# Altium project SunS_fixture_EGSE.PrjPcb
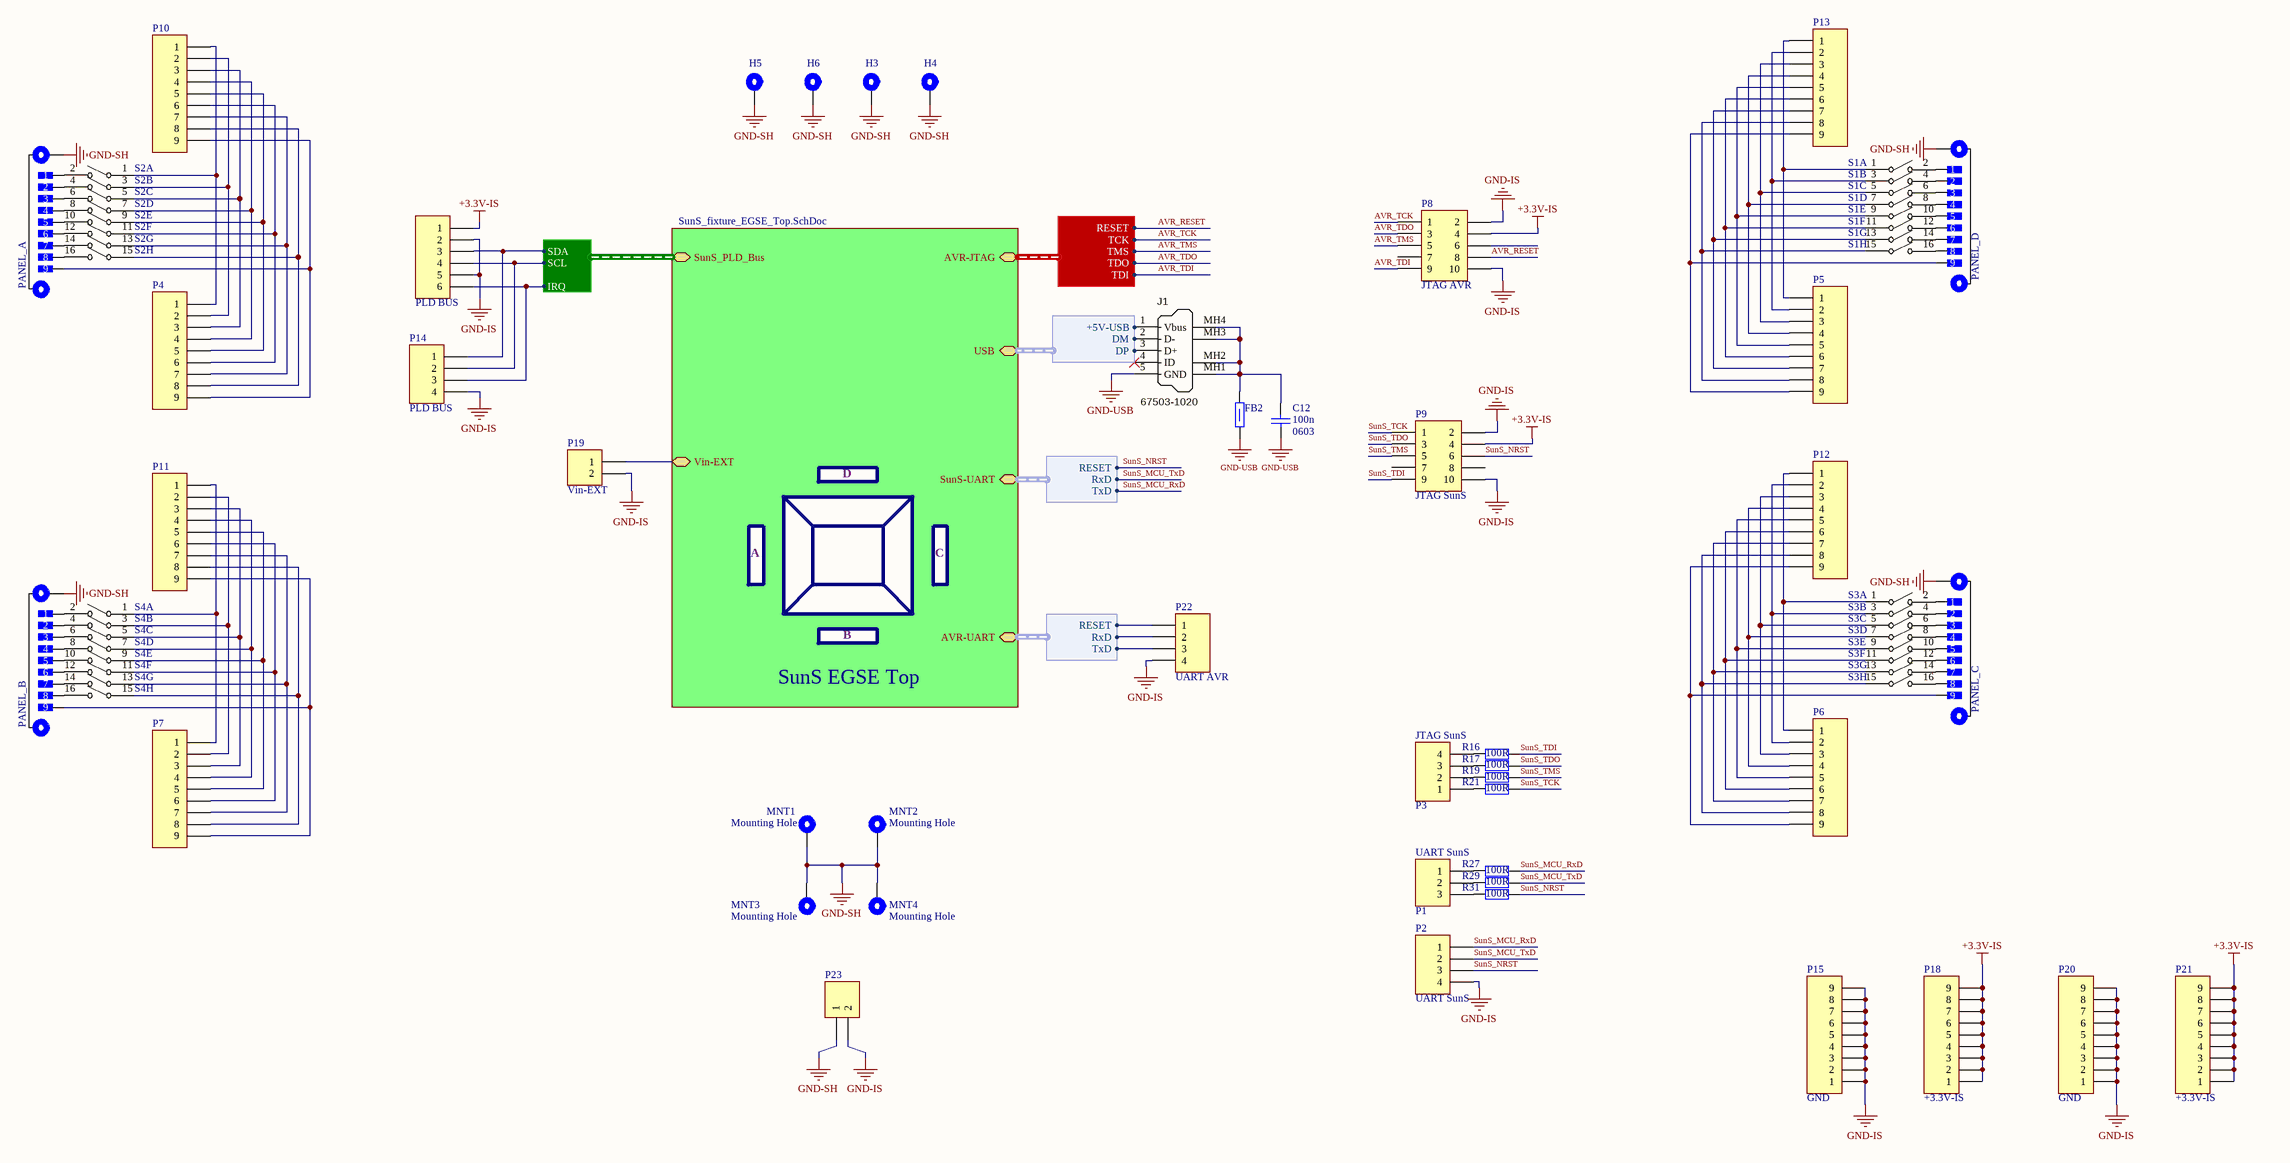
[diagram p0: SunS_fixture_EGSE_Connectors.SchDoc]
ApprovedBy_Name: (not approved); Author_Name: Micha³ Gumiela; CheckedBy_Name: (not checked); Equipment: Fixture EGSE; Model: EGSE; PCB_Author: (pcbdoc author); PCB_CheckedBy: (not checked); PCB_DocName: Fixture EGSE; PCB_DocNo: PWSat2-xxx-DW-xxx; PCB_Id: Fixture EGSE; PCB_Revision: 1; Project_FullName: PW-Sat2; Project_Id: SunS Fixture EGSE; Project_ShortName: SunS; Schematics_DocName: Fixture EGSE; Schematics_DocNo: PWSat2-xxx-DW-xxx; Schematics_Revision: 1; Subsystem: SunS
7 sheets, 120 parts. Net scope: hierarchical (ports join the sheet entries above them; power ports are global).
Board file: SunS_fixture_EGSE.PcbDoc
Sheets:
  SunS_fixture_EGSE_Connectors.SchDoc
    SunS EGSE Top = SunS_fixture_EGSE_Top.SchDoc
      SunS_UART = SunS_fixture_EGSE_UART_Isolation.SchDoc
      FTDI = SunS_fixture_EGSE_FTDI.SchDoc
      AVR = SunS_fixture_EGSE_AVR.SchDoc
      External Supply = SunS_fixture_EGSE_External_Supply.SchDoc
      LDO = SunS_fixture_EGSE_LDO.SchDoc
      AVR_UART = SunS_fixture_EGSE_UART_Isolation.SchDoc

## Sheet SunS_fixture_EGSE_Connectors.SchDoc: Connectors
size A1; Author: Michał Gumiela; ProjectName: SunS

### Parts
C12  value 100n  Package: 0603  [SMD_Capacitor_0603]  (hidden comment: Cap)
FB2  120R/100MHz  [SMD_FerriteBead_1206]  (value not drawn)
H3  Mounting Hole  [SunS_PcbMntHole_M2]  (value not drawn)
H4  Mounting Hole  [SunS_PcbMntHole_M2]  (value not drawn)
H5  Mounting Hole  [SunS_PcbMntHole_M2]  (value not drawn)
H6  Mounting Hole  [SunS_PcbMntHole_M2]  (value not drawn)
J1  Manufacturer Part Number 1: 67503-1020  [USB_Mini-B_Molex_SMT]  (hidden comment: USB_Mini-B)
MNT1  Mounting Hole  [PC-104_PcbMntHole_M3]
MNT2  Mounting Hole  [PC-104_PcbMntHole_M3]
MNT3  Mounting Hole  [PC-104_PcbMntHole_M3]
MNT4  Mounting Hole  [PC-104_PcbMntHole_M3]
P1  UART SunS  [Mill-Max 854-22-003-10-001101]
P2  UART SunS  [HEADER 1x4 MALE]
P3  JTAG SunS  [Mill-Max 854-22-004-10-001101]
P4  Mill-Max 854-22-009-10-001101  [Mill-Max 854-22-009-10-001101]  (value not drawn)
P5  Mill-Max 854-22-009-10-001101  [Mill-Max 854-22-009-10-001101]  (value not drawn)
P6  Mill-Max 854-22-009-10-001101  [Mill-Max 854-22-009-10-001101]  (value not drawn)
P7  Mill-Max 854-22-009-10-001101  [Mill-Max 854-22-009-10-001101]  (value not drawn)
P8  JTAG AVR  [IDC-10-Male-Socket]
P9  JTAG SunS  [IDC-10-Male-Socket]
P10  Header 9  [HEADER 1x9 MALE]  (value not drawn)
P11  Header 9  [HEADER 1x9 MALE]  (value not drawn)
P12  Header 9  [HEADER 1x9 MALE]  (value not drawn)
P13  Header 9  [HEADER 1x9 MALE]  (value not drawn)
P14  PLD BUS  [HEADER 1x4 MALE]
P15  GND  [HEADER 1x9 MALE]
P18  +3.3V-IS  [HEADER 1x9 MALE]
P19  Vin-EXT  [HEADER 1X2H Male]
P20  GND  [HEADER 1x9 MALE]
P21  +3.3V-IS  [HEADER 1x9 MALE]
P22  UART AVR  [HEADER 1x4 MALE]
P23  Header 2  [HEADER 1X2 Male]  (value not drawn)
PANEL_A  fixture_ALS_9_pad_1mm_pitch  [fixture_ALS_9_pad_1mm_pitch]  (value not drawn)
PANEL_B  fixture_ALS_9_pad_1mm_pitch  [fixture_ALS_9_pad_1mm_pitch]  (value not drawn)
PANEL_C  fixture_ALS_9_pad_1mm_pitch  [fixture_ALS_9_pad_1mm_pitch]  (value not drawn)
PANEL_D  fixture_ALS_9_pad_1mm_pitch  [fixture_ALS_9_pad_1mm_pitch]  (value not drawn)
PLD_BUS  Mill-Max 854-22-006-10-001101  [Mill-Max 854-22-006-10-001101]  (value not drawn)
R16  100R  [SMD_Resistor_0603]
R17  100R  [SMD_Resistor_0603]
R19  100R  [SMD_Resistor_0603]
R21  100R  [SMD_Resistor_0603]
R27  100R  [SMD_Resistor_0603]
R29  100R  [SMD_Resistor_0603]
R31  100R  [SMD_Resistor_0603]
S1  MCEPM-08  [MCEPM-08]  (value not drawn)  (parts A,B,C,D,E,F,G,H of 8)
S2  MCEPM-08  [MCEPM-08]  (value not drawn)  (parts A,B,C,D,E,F,G,H of 8)
S3  MCEPM-08  [MCEPM-08]  (value not drawn)  (parts A,B,C,D,E,F,G,H of 8)
S4  MCEPM-08  [MCEPM-08]  (value not drawn)  (parts A,B,C,D,E,F,G,H of 8)

### Sub-sheets
SunS EGSE Top = SunS_fixture_EGSE_Top.SchDoc: SunS_PLD_Bus (harness SunS_PLD_Bus), AVR-JTAG (harness JTAG), USB (harness USB), SunS-UART (harness UART), Vin-EXT, AVR-UART (harness UART)

### Harnesses
SunS_PLD_Bus: SCL, SDA, IRQ
JTAG: TDO, TDI, TMS, TCK, RESET
USB: DM, DP, +5V-USB
UART: TxD, RxD, RESET

### Nets
+3.3V-IS: P8.4 P9.4 P18.1 P18.2 P18.3 P18.4 P18.5 P18.6 P18.7 P18.8 P18.9 P21.1 P21.2 P21.3 P21.4 P21.5 P21.6 P21.7 P21.8 P21.9 PLD_BUS.1
GND-IS: P2.4 P8.2 P8.10 P9.2 P9.10 P14.4 P15.1 P15.2 P15.3 P15.4 P15.5 P15.6 P15.7 P15.8 P15.9 P19.2 P20.1 P20.2 P20.3 P20.4 P20.5 P20.6 P20.7 P20.8 P20.9 P22.4 P23.2 PLD_BUS.2 PLD_BUS.5
GND-SH: H3.1 H4.1 H5.1 H6.1 MNT1.1 MNT2.1 MNT3.1 MNT4.1 P23.1 PANEL_A.0 PANEL_B.0 PANEL_C.0 PANEL_D.0
GND-USB: C12.2 FB2.2 J1.5(GND)
_IRQ: P14.3 PLD_BUS.6 ; sheet SunS EGSE Top/SunS_PLD_Bus.IRQ
_SCL: P14.2 PLD_BUS.4 ; sheet SunS EGSE Top/SunS_PLD_Bus.SCL
_SDA: P14.1 PLD_BUS.3 ; sheet SunS EGSE Top/SunS_PLD_Bus.SDA
AVR_RESET: P8.8 ; sheet SunS EGSE Top/AVR-JTAG.RESET
AVR_TCK: P8.1 ; sheet SunS EGSE Top/AVR-JTAG.TCK
AVR_TDI: P8.9 ; sheet SunS EGSE Top/AVR-JTAG.TDI
AVR_TDO: P8.3 ; sheet SunS EGSE Top/AVR-JTAG.TDO
AVR_TMS: P8.5 ; sheet SunS EGSE Top/AVR-JTAG.TMS
DTR#1: P22.1 ; sheet SunS EGSE Top/AVR-UART.RESET
RxD1: P22.2 ; sheet SunS EGSE Top/AVR-UART.RxD
SunS_MCU_RxD: P2.1 R27.1 ; sheet SunS EGSE Top/SunS-UART.TxD
SunS_MCU_TxD: P2.2 R29.1 ; sheet SunS EGSE Top/SunS-UART.RxD
SunS_NRST: P2.3 P9.6 R31.1 ; sheet SunS EGSE Top/SunS-UART.RESET
SunS_TCK: P9.1 R21.1
SunS_TDI: P9.9 R16.1
SunS_TDO: P9.3 R17.1
SunS_TMS: P9.5 R19.1
TxD1: P22.3 ; sheet SunS EGSE Top/AVR-UART.TxD
USB_N: J1.2(D-) ; sheet SunS EGSE Top/USB.DM
USB_P: J1.3(D+) ; sheet SunS EGSE Top/USB.DP
NetC12_1: C12.1 FB2.1 J1.MH1(Shell) J1.MH2(Shell) J1.MH3(Shell) J1.MH4(Shell)
NetFB1_2: J1.1(Vbus) ; sheet SunS EGSE Top/USB.+5V-USB
NetP1_1: P1.1 R27.2
NetP1_2: P1.2 R29.2
NetP1_3: P1.3 R31.2
NetP3_1: P3.1 R21.2
NetP3_2: P3.2 R19.2
NetP3_3: P3.3 R17.2
NetP3_4: P3.4 R16.2
NetP4_1: P4.1 P10.1 S2.1
NetP4_2: P4.2 P10.2 S2.3
NetP4_3: P4.3 P10.3 S2.5
NetP4_4: P4.4 P10.4 S2.7
NetP4_5: P4.5 P10.5 S2.9
NetP4_6: P4.6 P10.6 S2.11
NetP4_7: P4.7 P10.7 S2.13
NetP4_8: P4.8 P10.8 S2.15
NetP4_9: P4.9 P10.9 PANEL_A.9
NetP5_1: P5.1 P13.1 S1.1
NetP5_2: P5.2 P13.2 S1.3
NetP5_3: P5.3 P13.3 S1.5
NetP5_4: P5.4 P13.4 S1.7
NetP5_5: P5.5 P13.5 S1.9
NetP5_6: P5.6 P13.6 S1.11
NetP5_7: P5.7 P13.7 S1.13
NetP5_8: P5.8 P13.8 S1.15
NetP5_9: P5.9 P13.9 PANEL_D.9
NetP6_1: P6.1 P12.1 S3.1
NetP6_2: P6.2 P12.2 S3.3
NetP6_3: P6.3 P12.3 S3.5
NetP6_4: P6.4 P12.4 S3.7
NetP6_5: P6.5 P12.5 S3.9
NetP6_6: P6.6 P12.6 S3.11
NetP6_7: P6.7 P12.7 S3.13
NetP6_8: P6.8 P12.8 S3.15
NetP6_9: P6.9 P12.9 PANEL_C.9
NetP7_1: P7.1 P11.1 S4.1
NetP7_2: P7.2 P11.2 S4.3
NetP7_3: P7.3 P11.3 S4.5
NetP7_4: P7.4 P11.4 S4.7
NetP7_5: P7.5 P11.5 S4.9
NetP7_6: P7.6 P11.6 S4.11
NetP7_7: P7.7 P11.7 S4.13
NetP7_8: P7.8 P11.8 S4.15
NetP7_9: P7.9 P11.9 PANEL_B.9
NetP19_1: P19.1 ; sheet SunS EGSE Top/Vin-EXT
NetPANEL_A_1: PANEL_A.1 S2.2
NetPANEL_A_2: PANEL_A.2 S2.4
NetPANEL_A_3: PANEL_A.3 S2.6
NetPANEL_A_4: PANEL_A.4 S2.8
NetPANEL_A_5: PANEL_A.5 S2.10
NetPANEL_A_6: PANEL_A.6 S2.12
NetPANEL_A_7: PANEL_A.7 S2.14
NetPANEL_A_8: PANEL_A.8 S2.16
NetPANEL_B_1: PANEL_B.1 S4.2
NetPANEL_B_2: PANEL_B.2 S4.4
NetPANEL_B_3: PANEL_B.3 S4.6
NetPANEL_B_4: PANEL_B.4 S4.8
NetPANEL_B_5: PANEL_B.5 S4.10
NetPANEL_B_6: PANEL_B.6 S4.12
NetPANEL_B_7: PANEL_B.7 S4.14
NetPANEL_B_8: PANEL_B.8 S4.16
NetPANEL_C_1: PANEL_C.1 S3.2
NetPANEL_C_2: PANEL_C.2 S3.4
NetPANEL_C_3: PANEL_C.3 S3.6
NetPANEL_C_4: PANEL_C.4 S3.8
NetPANEL_C_5: PANEL_C.5 S3.10
NetPANEL_C_6: PANEL_C.6 S3.12
NetPANEL_C_7: PANEL_C.7 S3.14
NetPANEL_C_8: PANEL_C.8 S3.16
NetPANEL_D_1: PANEL_D.1 S1.2
NetPANEL_D_2: PANEL_D.2 S1.4
NetPANEL_D_3: PANEL_D.3 S1.6
NetPANEL_D_4: PANEL_D.4 S1.8
NetPANEL_D_5: PANEL_D.5 S1.10
NetPANEL_D_6: PANEL_D.6 S1.12
NetPANEL_D_7: PANEL_D.7 S1.14
NetPANEL_D_8: PANEL_D.8 S1.16

Not connected (* = marked no-connect by the designer): J1 4(ID)*; P8 6 7; P9 7 8

### Notes on the sheet
- D
- A
- C
- B
- Title:
- Project:
- Author:
- Model:
- File name:
- Document Number:
- Checked by:
- Rev:
- Date:
- Approved by:
- Sheet:
- of

### Library data of the parts
FB2 = BLM31PG121SH1L: Ferrite bead, 1206, 0.02HM, 3.5A.; Manufacturer: Murata; Current Rating: 3.5A; Series Resistance DC: 0.02R; Package: 1206; Value: 120R/100MHz; ManufacturerPartNumber: BLM31PG121SH1L
H3-H6 MNT1-MNT4 = MntHole: PCB Mounting Hole; Value: Mounting Hole
J1 = USB_Mini-B: Connector SMD USB Type Mini-B; Manufacturer 1: Molex Connector Corporation; SCDType: undef; Package / Case: SMD; Supplier 1: Digi-Key; Supplier Part Number 1: WM5461CT-ND
P1 = Mill-Max 854-22-003-10-001101: SPRING-LOADED CONNECTORS, 854-22-003-10-001101, 1.27 mm pitch, 1x3pin, THT
P2 P22 = Header 4: Header, 4-Pin; LatestRevisionDate: 17-Jul-2002; LatestRevisionNote: Re-released for DXP Platform.; Publisher: Altium Limited
P3 = Mill-Max 854-22-004-10-001101: SPRING-LOADED CONNECTORS, 854-22-004-10-001101, 1.27 mm pitch, 1x4pin, THT.
P4-P7 = Mill-Max 854-22-009-10-001101: SPRING-LOADED CONNECTORS, 854-22-009-10-001101, 1.27 mm pitch, 1x9pin, THT.
P8 P9 = Header 5X2: Header, 5-Pin, Dual row
P10-P13 P15 P18 P20 P21 = Header 9: Header, 9-Pin; LatestRevisionDate: 17-Jul-2002; LatestRevisionNote: Re-released for DXP Platform.; Publisher: Altium Limited
P14 = Header 4x1: Header, 4-Pin; LatestRevisionDate: 17-Jul-2002; LatestRevisionNote: Re-released for DXP Platform.; Publisher: Altium Limited
P19 P23 = Header 2: Header, 2-Pin; LatestRevisionDate: 17-Jul-2002; LatestRevisionNote: Re-released for DXP Platform.; Publisher: Altium Limited
PANEL_A PANEL_B PANEL_C PANEL_D = fixture_ALS_9_pad_1mm_pitch: ALS Panel Fixture Connection; Value: fixture_ALS_9_pad_1mm_pitch
PLD_BUS = Mill-Max 854-22-006-10-001101: SPRING-LOADED CONNECTORS, 854-22-006-10-001101, 1.27 mm pitch, 1x6pin, THT.
R16 R17 R19 R21 R27 R29 R31 = Res: Value: 100R; Package: 0603
S1-S4 = MCEPM-08: Supplier 1: Farnell

## Sheet SunS_fixture_EGSE_Top.SchDoc: Top
size A3; Author: Michał Gumiela; ProjectName: SunS
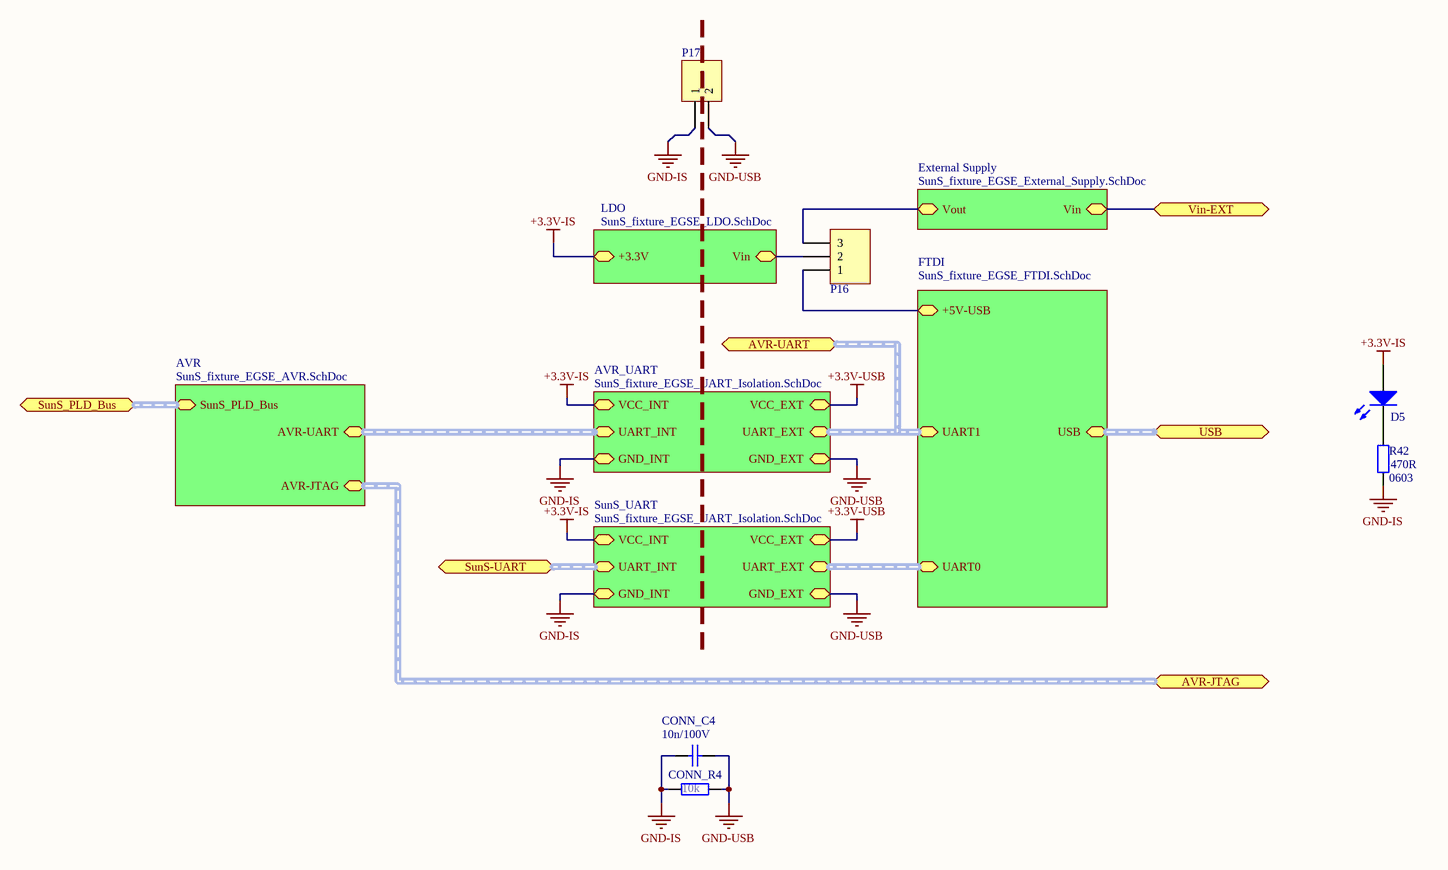
[diagram p1: SunS_fixture_EGSE_Top.SchDoc]

### Parts
CONN_C4  10n/100V  [SMD_Capacitor_0805]
CONN_R4  10k  [SMD_Resistor_0805]
D5  LEDX  [LED 0805 RED]  (value not drawn)
P16  Header 3  [HEADER 1X3 MALE]  (value not drawn)
P17  Header 2  [HEADER 1X2 Male]  (value not drawn)
R42  Package: 0603  [SMD_Resistor_0603]  (hidden comment: 470R)

### Sub-sheets
AVR = SunS_fixture_EGSE_AVR.SchDoc: SunS_PLD_Bus (harness SunS_PLD_Bus), AVR-UART (harness UART), AVR-JTAG (harness JTAG)
AVR_UART = SunS_fixture_EGSE_UART_Isolation.SchDoc: UART_INT (harness UART), UART_EXT (harness UART), GND_INT, VCC_INT, GND_EXT, VCC_EXT
External Supply = SunS_fixture_EGSE_External_Supply.SchDoc: Vout, Vin
FTDI = SunS_fixture_EGSE_FTDI.SchDoc: UART0 (harness UART), UART1 (harness UART), USB (harness USB), +5V-USB
LDO = SunS_fixture_EGSE_LDO.SchDoc: Vin, +3.3V
SunS_UART = SunS_fixture_EGSE_UART_Isolation.SchDoc: UART_INT (harness UART), UART_EXT (harness UART), GND_INT, VCC_INT, GND_EXT, VCC_EXT

### Ports
AVR-JTAG (harness JTAG), AVR-UART (harness UART), SunS-UART (harness UART), SunS_PLD_Bus (harness SunS_PLD_Bus), USB (harness SunS_PLD_Bus), Vin-EXT

### Nets
+3.3V-IS: D5.1(A) ; sheet SunS_UART/VCC_INT, sheet LDO/+3.3V, sheet AVR_UART/VCC_INT
+3.3V-USB: sheet SunS_UART/VCC_EXT, sheet AVR_UART/VCC_EXT
+5V-USB: P16.1 ; sheet FTDI/+5V-USB
GND-IS: CONN_C4.1 CONN_R4.1 P17.1 R42.1 ; sheet SunS_UART/GND_INT, sheet AVR_UART/GND_INT
GND-USB: CONN_C4.2 CONN_R4.2 P17.2 ; sheet SunS_UART/GND_EXT, sheet AVR_UART/GND_EXT
NetC9_1: P16.2 ; sheet LDO/Vin
NetD5_2: D5.2(K) R42.2
NetP16_3: P16.3 ; sheet External Supply/Vout
NetP19_1: port Vin-EXT, sheet External Supply/Vin

### Buses and harness runs
harness port AVR-JTAG = sheet AVR/AVR-JTAG
harness port AVR-UART = sheet AVR_UART/UART_EXT = sheet FTDI/UART1
harness port SunS-UART = sheet SunS_UART/UART_INT
harness port SunS_PLD_Bus = sheet AVR/SunS_PLD_Bus
harness port USB = sheet FTDI/USB
harness sheet AVR/AVR-UART = sheet AVR_UART/UART_INT
harness sheet FTDI/UART0 = sheet SunS_UART/UART_EXT

### Notes on the sheet
- Title:
- Project:
- Author:
- Model:
- Document Number:
- Checked by:
- Rev:
- Date:
- Approved by:
- Sheet:
- of
- File name:

### Library data of the parts
CONN_C4 = Cer_C0805T104K1RCLTU: Ceramic Cap Kemet COTS 100n/100V X7R 0805; ManufacturerPartNumber: C0805T104K1RCLTU; Manufacturer: Kemet; Package: 0805; Value: 10n/100V
CONN_R4 = CRCW08051K00FKxxxx: 1k/1% Vishay CRCW 0805 Resistor. 125mW, 100ppm, 150V.; Manufacturer: Vishay; ManufacturerPartNumber: CRCW08051K00FKxxxx; Value: 10k; Package: 0805
D5 = LEDX: Typical LED
P16 = Header 3: Header, 3-Pin; LatestRevisionDate: 17-Jul-2002; LatestRevisionNote: Re-released for DXP Platform.; Publisher: Altium Limited
P17 = Header 2: Header, 2-Pin; LatestRevisionDate: 17-Jul-2002; LatestRevisionNote: Re-released for DXP Platform.; Publisher: Altium Limited
R42 = Res: Value: 470R

## Sheet SunS_fixture_EGSE_UART_Isolation.SchDoc: Connectors
size A4; Author: Michał Gumiela; ProjectName: SunS
Used 2 times, as channels SunS EGSE Top/SunS_UART, SunS EGSE Top/AVR_UART. Parts and nets are listed once, with the designators drawn on the sheet.
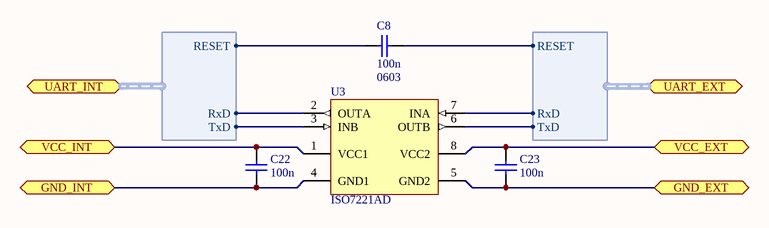
[diagram p2: SunS_fixture_EGSE_UART_Isolation.SchDoc]

### Parts
C8  value 100n  Package: 0603  [SMD_Capacitor_0603]  (hidden comment: Cap)
C22  value 100n  [SMD_Capacitor_0603]  (hidden comment: Cap)
C23  value 100n  [SMD_Capacitor_0603]  (hidden comment: Cap)
U3  ISO7221AD  [D0008A_N]

### Ports
GND_EXT, GND_INT, UART_EXT (harness UART), UART_INT (harness UART), VCC_EXT, VCC_INT

### Harnesses
UART: TxD, RxD, RESET

### Nets
GND_EXT: C23.2 U3.5(GND2) ; port GND_EXT
GND_INT: C22.2 U3.4(GND1) ; port GND_INT
VCC_EXT: C23.1 U3.8(VCC2) ; port VCC_EXT
VCC_INT: C22.1 U3.1(VCC1) ; port VCC_INT
NetC8_1: C8.1 ; port UART_INT.RESET
NetC8_2: C8.2 ; port UART_EXT.RESET
NetU3_2: U3.2(OUTA) ; port UART_INT.RxD
NetU3_3: U3.3(INB) ; port UART_INT.TxD
NetU3_6: U3.6(OUTB) ; port UART_EXT.TxD
NetU3_7: U3.7(INA) ; port UART_EXT.RxD

### Channels
SunS EGSE Top/SunS_UART: designators end in _SunS_UART; ports GND_EXT=GND-USB GND_INT=GND-IS VCC_EXT=+3.3V-USB VCC_INT=+3.3V-IS
SunS EGSE Top/AVR_UART: designators end in _AVR_UART; ports GND_EXT=GND-USB GND_INT=GND-IS VCC_EXT=+3.3V-USB VCC_INT=+3.3V-IS

### Notes on the sheet
- Title:
- Project:
- Author:
- Model:
- Document Number:
- Checked by:
- Rev:
- Date:
- Approved by:
- Sheet:
- of
- File name:

### Library data of the parts
U3 = ISO7221AD: 1 Mbps Dual Channels, 1 / 1, Digital Isolator, 3.3 V / 5 V, -40 to +125 degC, 8-pin SOIC (D), Green (RoHS & no Sb/Br); Manufacturer: Texas Instruments; Datarate(Mbps): 1; Input Noise Filter: Yes; Insulation Rating(VRMS): 2500; Prop Delay(Max)(ns): 475; Rating: Catalog; Supply Voltage(s)(V): 3.3, 5; TTL/CMOS Input Threshold: TTL; DatasheetVersion: SLLS755L; PackageVersion: 4040047-3/M, 06/2011; PackageReference: D0008A; PackageDescription: 8-Pin Plastic Small Outline, Body 4.9 x 3.9 mm, Pitch 1.27 mm; Supplier 1: Digi-Key; Supplier Part Number 1: 296-26077-5-ND; Supplier 2: Farnell; Supplier Part Number 2: 1390651; Supplier 3: Newark; Supplier Part Number 3: 48M0672; Supplier 4: Mouser; Supplier Part Number 4: 595-ISO7221AD; Eco-Plan: Green (RoHS & no Sb/Br); SubFamily: Isolator; Thermal Shutdown: No; MountType: SMT; Code_JEDEC: MS-012; PartNumber: ISO7221AD; ComponentLink1Description: Manufacturer URL; ComponentLink1URL: http://www.ti.com/; ComponentLink2Description: Datasheet; ComponentLink2URL: http://www.ti.com/general/docs/lit/getliterature.tsp?genericPartNumber=ISO7221A&fileType=pdf; ComponentLink3Description: Package Specification; ComponentLink3URL: http://www.ti.com/litv/pdf/msoi002j; ComponentLink4Description: SamplesURL; ComponentLink4URL: http://www.ti.com/product/iso7221a#samples
C8 C22 C23 = Cap
  C22 C23: Package: 0603

## Sheet SunS_fixture_EGSE_FTDI.SchDoc: Connectors
size A3; Author: Michał Gumiela; ProjectName: SunS
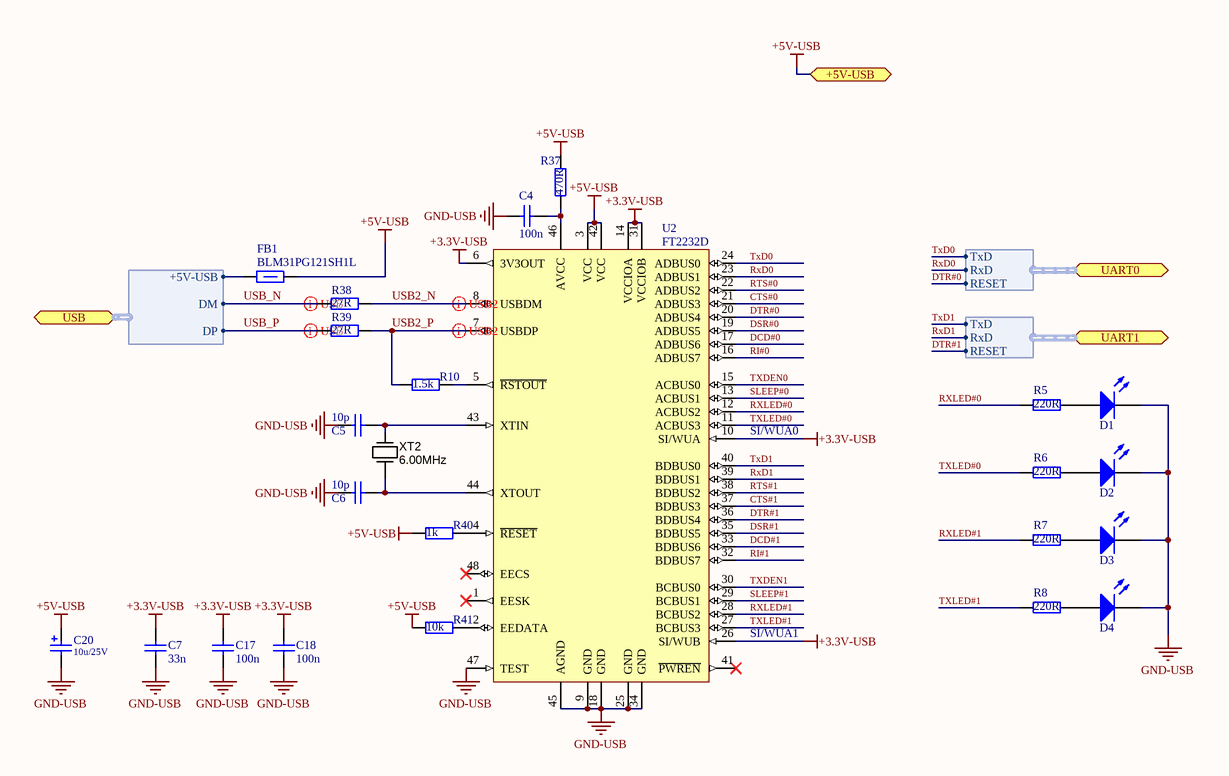
[diagram p3: SunS_fixture_EGSE_FTDI.SchDoc]

### Parts
C4  value 100n  [SMD_Capacitor_0603]  (hidden comment: Cap)
C5  value 10p  [SMD_Capacitor_0603]  (hidden comment: Cap)
C6  value 10p  [SMD_Capacitor_0603]  (hidden comment: Cap)
C7  value 33n  [SMD_Capacitor_0603]  (hidden comment: Cap)
C17  value 100n  [SMD_Capacitor_0603]  (hidden comment: Cap)
C18  value 100n  [SMD_Capacitor_0603]  (hidden comment: Cap)
C20  10u/25V  [Tantalum_cap_D]
D1  LEDX  [LED 0805 RED]  (value not drawn)
D2  LEDX  [LED 0805 RED]  (value not drawn)
D3  LEDX  [LED 0805 RED]  (value not drawn)
D4  LEDX  [LED 0805 RED]  (value not drawn)
FB1  120R/100MHz  [SMD_FerriteBead_1206]  (value not drawn)
R5  220R  [SMD_Resistor_0603]
R6  220R  [SMD_Resistor_0603]
R7  220R  [SMD_Resistor_0603]
R8  220R  [SMD_Resistor_0603]
R10  1.5k  [SMD_Resistor_0603]
R37  470R  [SMD_Resistor_0603]
R38  27R  [SMD_Resistor_0603]
R39  27R  [SMD_Resistor_0603]
R40  1k  [SMD_Resistor_0603]
R41  10k  [SMD_Resistor_0603]
U2  FT2232D  [LQFP-48_N]
XT2  6.00MHz  [HC49U]

### Ports
+5V-USB, UART0 (harness UART), UART1 (harness UART), USB (harness USB)

### Harnesses
USB: DM, DP, +5V-USB
UART: TxD, RxD, RESET

### Nets
+3.3V-USB: C7.1 C17.1 C18.1 U2.6(3V3OUT) U2.10(SI/WUA) U2.14(VCCIOA) U2.26(SI/WUB) U2.31(VCCIOB)
+5V-USB: C20.1 FB1.1 R37.2 R40.1 R41.1 U2.3(VCC) U2.42(VCC) ; port +5V-USB
GND-USB: C4.2 C5.2 C6.2 C7.2 C17.2 C18.2 C20.2 D1.2(K) D2.2(K) D3.2(K) D4.2(K) U2.9(GND) U2.18(GND) U2.25(GND) U2.34(GND) U2.45(AGND) U2.47(TEST)
CTS#0: U2.21(ADBUS3)
CTS#1: U2.37(BDBUS3)
DCD#0: U2.17(ADBUS6)
DCD#1: U2.33(BDBUS6)
DSR#0: U2.19(ADBUS5)
DSR#1: U2.35(BDBUS5)
DTR#0: U2.20(ADBUS4) ; port UART0.RESET
DTR#1: U2.36(BDBUS4) ; port UART1.RESET
RI#0: U2.16(ADBUS7)
RI#1: U2.32(BDBUS7)
RTS#0: U2.22(ADBUS2)
RTS#1: U2.38(BDBUS2)
RxD0: U2.23(ADBUS1) ; port UART0.RxD
RxD1: U2.39(BDBUS1) ; port UART1.RxD
RXLED#0: R5.1 U2.12(ACBUS2)
RXLED#1: R7.1 U2.28(BCBUS2)
SLEEP#0: U2.13(ACBUS1)
SLEEP#1: U2.29(BCBUS1)
TxD0: U2.24(ADBUS0) ; port UART0.TxD
TxD1: U2.40(BDBUS0) ; port UART1.TxD
TXDEN0: U2.15(ACBUS0)
TXDEN1: U2.30(BCBUS0)
TXLED#0: R6.1 U2.11(ACBUS3)
TXLED#1: R8.1 U2.27(BCBUS3)
USB2_N: R38.1 U2.8(USBDM)
USB2_P: R10.1 R39.1 U2.7(USBDP)
USB_N: R38.2 ; port USB.DM
USB_P: R39.2 ; port USB.DP
NetC4_1: C4.1 R37.1 U2.46(AVCC)
NetC5_1: C5.1 U2.43(XTIN) XT2.2(OUT)
NetC6_1: C6.1 U2.44(XTOUT) XT2.1(IN)
NetD1_1: D1.1(A) R5.2
NetD2_1: D2.1(A) R6.2
NetD3_1: D3.1(A) R7.2
NetD4_1: D4.1(A) R8.2
NetFB1_2: FB1.2 ; port USB.+5V-USB
NetR10_2: R10.2 U2.5(~{RSTOUT})
NetR40_2: R40.2 U2.4(~{RESET})
NetR41_2: R41.2 U2.2(EEDATA)

Not connected (* = marked no-connect by the designer): U2 1(EESK)* 41(~{PWREN})* 48(EECS)*

### Layout directives
differential pair: USB2_N, USB2_P, USB_N, USB_P

### Notes on the sheet
- (near U2) SI/WUA0
- (near U2) SI/WUA1
- Title:
- Project:
- Author:
- Model:
- Document Number:
- Checked by:
- Rev:
- Date:
- Approved by:
- Sheet:
- of
- File name:

### Library data of the parts
C20 = TantS_CWR11_10u_25V: Tantalum Capacitor CWR11 10u/22V.; ManufacturerPartNumber: CWR11K(6)106(1)(2)(5); Manufacturer: Kemet; Value: 10u/25V
D1-D4 = LEDX: Typical LED
FB1 = BLM31PG121SH1L: as FB2 on sheet SunS_fixture_EGSE_Connectors; Package: 1206; Value: 120R/100MHz; ManufacturerPartNumber: BLM31PG121SH1L
R5-R8 R10 R37-R41 = Res: Package: 0603
  R5-R8: Value: 220R
  R10: Value: 1.5k
  R37: Value: 470R
  R38 R39: Value: 27R
  R40: Value: 1k
  R41: Value: 10k
U2 = FT2232D: FT2232D Dual USB to Serial UART/FIFO IC, -40 to +85 degC, 48-pin LQFP; Manufacturer: FTDI; DatasheetVersion: ver 2.05, Apr-2011; PackageVersion: Apr-11; PackageReference: LQFP-48; PackageDescription: 48-Pin Thin Quad Flat Pack, 7 x 7 mm Body, 0.5 mm Pitch; PartNumber: FT2232D; ComponentLink1Description: Manufacturer URL; ComponentLink1URL: http://www.ftdichip.com/; ComponentLink2Description: Datasheet; ComponentLink2URL: http://www.ftdichip.com/Support/Documents/DataSheets/ICs/DS_FT2232D.pdf
XT2 = Crystal: Resonator Ceramic; Manufacturer 1: Citizen Finetech Miyota; Manufacturer Part Number 1: CMR309T-6.000MABJ-UT; Frequency: 6MHz; Frequency Stability: ±50ppm; Frequency Tolerance: ±30ppm; Load Capacitance: 18pF; Operating Mode: Fundamental; SCDType: spec; Package / Case: Cylindrical Can, Radial; Ratings: 6.00 MHz; Type: MHz Crystal; Operating Temperature: -10°C ~ 60°C; Mounting Type: Surface Mount; Size / Dimension: 0.118" Dia x 0.346" L (3.00mm x 8.80mm); Height: 0.122" (3.10mm); Supplier 1: Digi-Key; Supplier Part Number 1: 300-8348-1-ND; Tolerance: ±50ppm; ComponentLink1URL: http://media.digikey.com/pdf/Data%20Sheets/Citizen%20PDFs/CMR310T%20CMR309T.pdf; ComponentLink1Description: http://media.digikey.com/pdf/Data%20Sheets/Citizen%20PDFs/CMR310T%20CMR309T.pdf; Value: 6.00MHz
C4-C7 C17 C18 = Cap: Package: 0603

## Sheet SunS_fixture_EGSE_AVR.SchDoc: Connectors
size A3; Author: Michał Gumiela; ProjectName: SunS
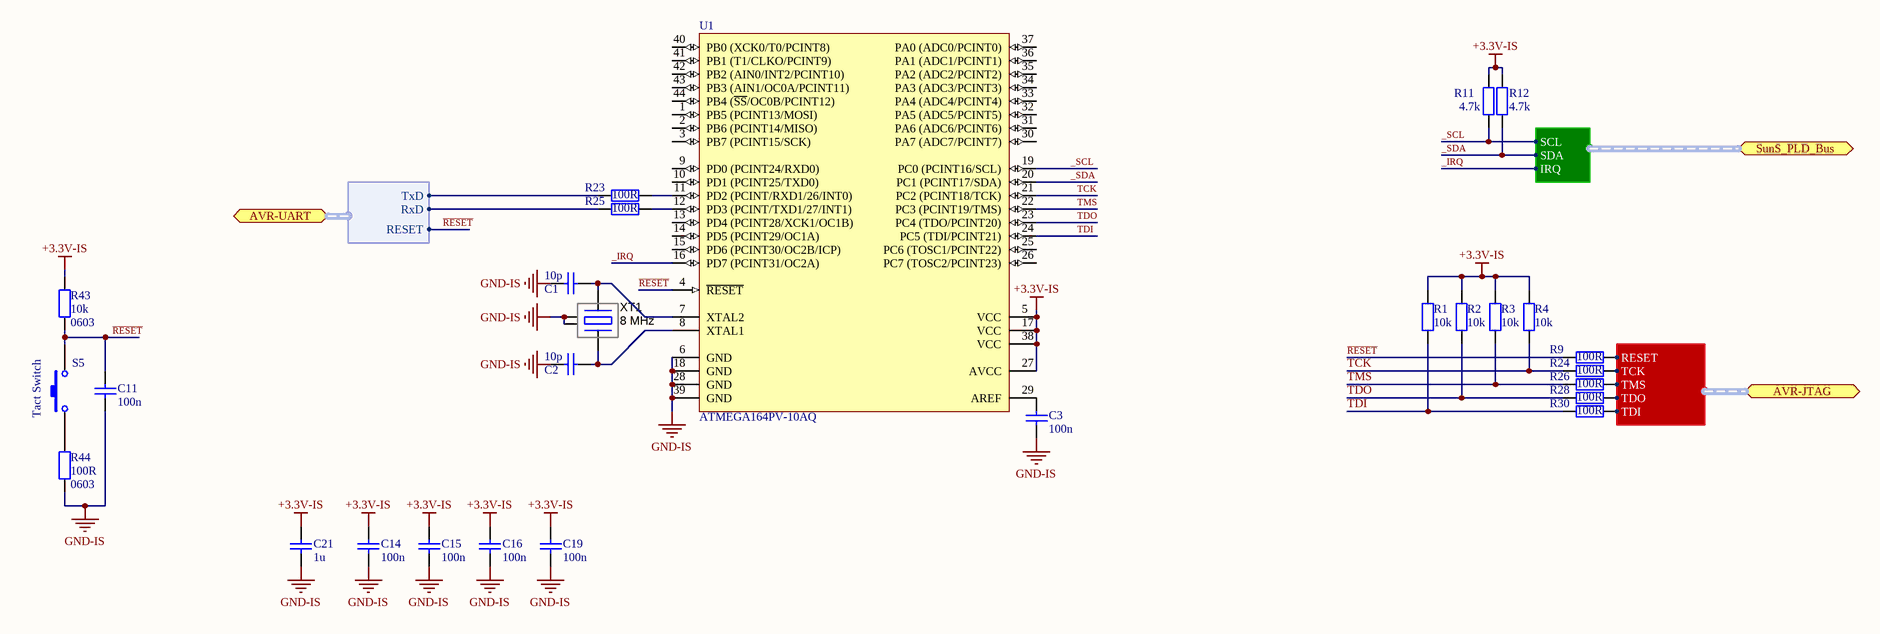
[diagram p4: SunS_fixture_EGSE_AVR.SchDoc]

### Parts
C1  value 10p  [SMD_Capacitor_0603]  (hidden comment: Cap)
C2  value 10p  [SMD_Capacitor_0603]  (hidden comment: Cap)
C3  value 100n  [SMD_Capacitor_0603]  (hidden comment: Cap)
C11  value 100n  [SMD_Capacitor_0603]  (hidden comment: Cap)
C14  value 100n  [SMD_Capacitor_0603]  (hidden comment: Cap)
C15  value 100n  [SMD_Capacitor_0603]  (hidden comment: Cap)
C16  value 100n  [SMD_Capacitor_0603]  (hidden comment: Cap)
C19  value 100n  [SMD_Capacitor_0603]  (hidden comment: Cap)
C21  value 1u  [SMD_Capacitor_1206]  (hidden comment: Cap)
R1  10k  [SMD_Resistor_0603]
R2  10k  [SMD_Resistor_0603]
R3  10k  [SMD_Resistor_0603]
R4  10k  [SMD_Resistor_0603]
R9  100R  [SMD_Resistor_0603]
R11  4.7k  [SMD_Resistor_0603]
R12  4.7k  [SMD_Resistor_0603]
R23  100R  [SMD_Resistor_0603]
R24  100R  [SMD_Resistor_0603]
R25  100R  [SMD_Resistor_0603]
R26  100R  [SMD_Resistor_0603]
R28  100R  [SMD_Resistor_0603]
R30  100R  [SMD_Resistor_0603]
R43  Package: 0603  [SMD_Resistor_0603]  (hidden comment: 10k)
R44  Package: 0603  [SMD_Resistor_0603]  (hidden comment: 100R)
S5  Tact Switch  [Tact Switch 3x6]
U1  ATMEGA164PV-10AQ  [TQFP-44]
XT1  8 MHz  [SMD, 5mm x 3.2mm]

### Ports
AVR-JTAG (harness JTAG), AVR-UART (harness UART), SunS_PLD_Bus (harness SunS_PLD_Bus)

### Harnesses
UART: TxD, RxD, RESET
SunS_PLD_Bus: SCL, SDA, IRQ
JTAG: TDO, TDI, TMS, TCK, RESET

### Nets
+3.3V-IS: C14.1 C15.1 C16.1 C19.1 C21.1 R1.1 R2.2 R3.2 R4.1 R11.1 R12.1 R43.1 U1.5(VCC) U1.17(VCC) U1.27(AVCC) U1.38(VCC)
GND-IS: C1.2 C2.2 C3.2 C11.2 C14.2 C15.2 C16.2 C19.2 C21.2 R44.2 U1.6(GND) U1.18(GND) U1.28(GND) U1.39(GND) XT1.2(GND) XT1.4(GND)
_IRQ: U1.16(PD7_(PCINT31/OC2A)) ; port SunS_PLD_Bus.IRQ
_SCL: R11.2 U1.19(PC0_(PCINT16/SCL)) ; port SunS_PLD_Bus.SCL
_SDA: R12.2 U1.20(PC1_(PCINT17/SDA)) ; port SunS_PLD_Bus.SDA
AVR_RESET: R9.1 ; port AVR-JTAG.RESET
AVR_TCK: R24.1 ; port AVR-JTAG.TCK
AVR_TDI: R30.1 ; port AVR-JTAG.TDI
AVR_TDO: R28.1 ; port AVR-JTAG.TDO
AVR_TMS: R26.1 ; port AVR-JTAG.TMS
~{RESET}: C11.1 R9.2 R43.2 S5.2 U1.4(~{RESET}) ; port AVR-UART.RESET
TCK: R4.2 R24.2 U1.21(PC2_(PCINT18/TCK))
TDI: R1.2 R30.2 U1.24(PC5_(TDI/PCINT21))
TDO: R2.1 R28.2 U1.23(PC4_(TDO/PCINT20))
TMS: R3.1 R26.2 U1.22(PC3_(PCINT19/TMS))
NetC1_1: C1.1 U1.7(XTAL2) XT1.1(inp)
NetC2_1: C2.1 U1.8(XTAL1) XT1.3(out)
NetC3_1: C3.1 U1.29(AREF)
NetR23_1: R23.1 ; port AVR-UART.TxD
NetR23_2: R23.2 U1.11(PD2_(PCINT/RXD1/26/INT0))
NetR25_1: R25.1 ; port AVR-UART.RxD
NetR25_2: R25.2 U1.12(PD3_(PCINT/TXD1/27/INT1))
NetR44_1: R44.1 S5.1

Not connected (* = marked no-connect by the designer): U1 1(PB5_(PCINT13/MOSI)) 2(PB6_(PCINT14/MISO)) 3(PB7_(PCINT15/SCK)) 9(PD0_(PCINT24/RXD0)) 10(PD1_(PCINT25/TXD0)) 13(PD4_(PCINT28/XCK1/OC1B)) 14(PD5_(PCINT29/OC1A)) 15(PD6_(PCINT30/OC2B/ICP)) 25(PC6_(TOSC1/PCINT22)) 26(PC7_(TOSC2/PCINT23)) 30(PA7_(ADC7/PCINT7)) 31(PA6_(ADC6/PCINT6)) 32(PA5_(ADC5/PCINT5)) 33(PA4_(ADC4/PCINT4)) 34(PA3_(ADC3/PCINT3)) 35(PA2_(ADC2/PCINT2)) 36(PA1_(ADC1/PCINT1)) 37(PA0_(ADC0/PCINT0)) 40(PB0_(XCK0/T0/PCINT8)) 41(PB1_(T1/CLKO/PCINT9)) 42(PB2_(AIN0/INT2/PCINT10)) 43(PB3_(AIN1/OC0A/PCINT11)) 44(PB4_(~{SS}/OC0B/PCINT12))

### Notes on the sheet
- Title:
- Project:
- Author:
- Model:
- Document Number:
- Checked by:
- Rev:
- Date:
- Approved by:
- Sheet:
- of
- File name:

### Library data of the parts
R1-R4 R9 R11 R12 R23-R26 R28 R30 R43 R44 = Res
  R1-R4: Value: 10k; Package: 0402
  R9 R23-R26 R28 R30: Value: 100R; Package: 0603
  R11 R12: Value: 4.7k; Package: 0603
  R43: Value: 10k
  R44: Value: 100R
S5 = TactSwitch: Supplier 1: Farnell
U1 = ATMEGA164PV-10AQ: General-purpose microcontroller; Value: ATMEGA164PV-10AQ
XT1 = ABM3B-8.000MHZ-B2-T: Resonator Ceramic; value: 8 MHz; Manufacturer Part Number: ABM3B-8.000MHZ-B2-T
C1-C3 C11 C14-C16 C19 C21 = Cap: Package: 0603

## Sheet SunS_fixture_EGSE_External_Supply.SchDoc: Connectors
size A4; Author: Michał Gumiela; ProjectName: SunS
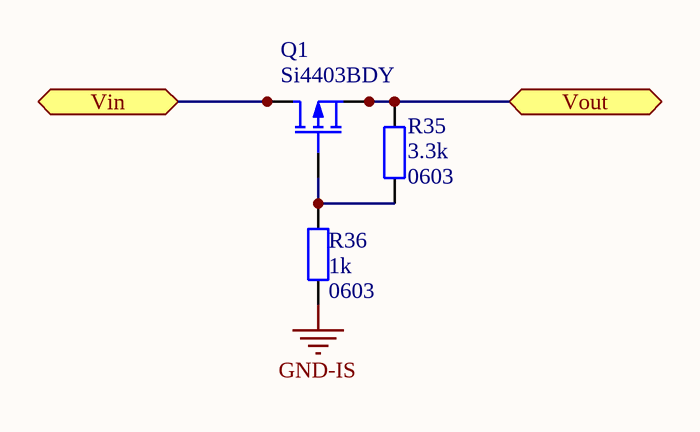
[diagram p5: SunS_fixture_EGSE_External_Supply.SchDoc]

### Parts
Q1  Si4403BDY  [SOIC-8_M]
R35  Package: 0603  [SMD_Resistor_0603]  (hidden comment: 3.3k)
R36  Package: 0603  [SMD_Resistor_0603]  (hidden comment: 1k)

### Ports
Vin, Vout

### Nets
GND-IS: R36.2
NetP16_3: Q1.1(S) Q1.2(S) Q1.3(S) R35.1 ; port Vout
NetP19_1: Q1.5(D) Q1.6(D) Q1.7(D) Q1.8(D) ; port Vin
NetQ1_4: Q1.4(G) R35.2 R36.1

### Notes on the sheet
- Title:
- Project:
- Author:
- Model:
- Document Number:
- Checked by:
- Rev:
- Date:
- Approved by:
- Sheet:
- of
- File name:

### Library data of the parts
Q1 = Si4403BDY: P-Channel 1.8 V (G-S) MOSFET; Manufacturer Part Number: Si4403BDY; value: Si4403BDY
R35 R36 = CRCW06031K00FKxxxx: 1k/1% Vishay CRCW 0603 Resistor. 100mW, 100ppm, 75V.; Manufacturer: Vishay; ManufacturerPartNumber: CRCW06031K00FKxxxx
  R35: Value: 3.3k
  R36: Value: 1k

## Sheet SunS_fixture_EGSE_LDO.SchDoc: Connectors
size A3; Author: Michał Gumiela; ProjectName: SunS
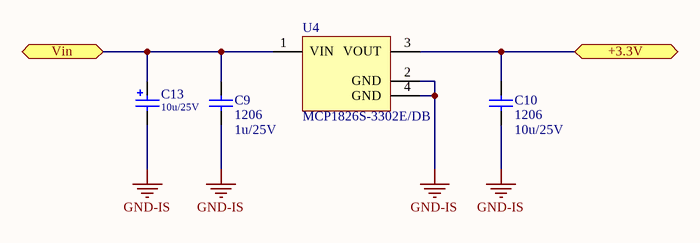
[diagram p6: SunS_fixture_EGSE_LDO.SchDoc]

### Parts
C9  Package: 1206  [SMD_Capacitor_1206]  (hidden comment: 1u/25V)
C10  Package: 1206  [SMD_Capacitor_1206]  (hidden comment: 10u/25V)
C13  10u/25V  [Tantalum_cap_D]
U4  MCP1826S-3302E/DB  [SOT-223-DB3_M]

### Ports
+3.3V, Vin

### Nets
+3.3V-IS: C10.1 U4.3(VOUT) ; port +3.3V
GND-IS: C9.2 C10.2 C13.2 U4.2(GND) U4.4(GND)
NetC9_1: C9.1 C13.1 U4.1(VIN) ; port Vin

### Notes on the sheet
- Title:
- Project:
- Author:
- Model:
- Document Number:
- Checked by:
- Rev:
- Date:
- Approved by:
- Sheet:
- of
- File name:

### Library data of the parts
C9 C10 = Cer_C1206T105K3RALTU: Ceramic Cap Kemet COTS 1u/25V X7R 1206; ManufacturerPartNumber: C1206T105K3RALTU; Manufacturer: Kemet
  C9: Value: 1u/25V
  C10: Value: 10u/25V
C13 = TantS_CWR11_10u_25V: as C20 on sheet SunS_fixture_EGSE_FTDI; Value: 10u/25V
U4 = MCP1826S-3302E/DB: 1000 mA, Low Voltage, Low Quiescent Current LDO Regulator, 3-Pin SOT-223, Extended Temperature; Manufacturer: Microchip; DatasheetVersion: revA, Aug-2007; PackageVersion: revBB, Aug-2009; PackageReference: SOT-223-DB3; PackageDescription: 3-Lead Plastic Small Outline Transistor (DB) [SOT-223]; Supplier 1: Digi-Key; Supplier Part Number 1: MCP1826S-3302E/DB-ND; Supplier 2: Newark; Supplier Part Number 2: 27M0037; Supplier 3: Mouser; Supplier Part Number 3: 579-MCP1826S-3302EDB; Mounting Technology: Surface Mount; PartNumber: MCP1826S-3302E/DB; ComponentLink1Description: Manufacturer URL; ComponentLink1URL: http://www.microchip.com/; ComponentLink2Description: Datasheet; ComponentLink2URL: http://ww1.microchip.com/downloads/en/DeviceDoc/22057a.pdf; ComponentLink3Description: Package Specification; ComponentLink3URL: http://www.microchip.com/stellent/groups/techpub_sg/documents/packagingspec/en012702.pdf

## Nets that join several sheets
+3.3V-IS: SunS_fixture_EGSE_Connectors (21 pins), SunS_fixture_EGSE_Top (D5.1), SunS EGSE Top/SunS_UART (C22_SunS_UART.1 U3_SunS_UART.1), SunS_fixture_EGSE_AVR (16 pins), SunS_fixture_EGSE_LDO (C10.1 U4.3), SunS EGSE Top/AVR_UART (C22_AVR_UART.1 U3_AVR_UART.1)
+3.3V-USB: SunS EGSE Top/SunS_UART (C23_SunS_UART.1 U3_SunS_UART.8), SunS_fixture_EGSE_FTDI (8 pins), SunS EGSE Top/AVR_UART (C23_AVR_UART.1 U3_AVR_UART.8)
+5V-USB: SunS_fixture_EGSE_Top (P16.1), SunS_fixture_EGSE_FTDI (7 pins)
GND-IS: SunS_fixture_EGSE_Connectors (29 pins), SunS_fixture_EGSE_Top (CONN_C4.1 CONN_R4.1 P17.1 R42.1), SunS EGSE Top/SunS_UART (C22_SunS_UART.2 U3_SunS_UART.4), SunS_fixture_EGSE_AVR (16 pins), SunS_fixture_EGSE_External_Supply (R36.2), SunS_fixture_EGSE_LDO (5 pins), SunS EGSE Top/AVR_UART (C22_AVR_UART.2 U3_AVR_UART.4)
GND-USB: SunS_fixture_EGSE_Connectors (C12.2 FB2.2 J1.5), SunS_fixture_EGSE_Top (CONN_C4.2 CONN_R4.2 P17.2), SunS EGSE Top/SunS_UART (C23_SunS_UART.2 U3_SunS_UART.5), SunS_fixture_EGSE_FTDI (17 pins), SunS EGSE Top/AVR_UART (C23_AVR_UART.2 U3_AVR_UART.5)
_IRQ: SunS_fixture_EGSE_Connectors (P14.3 PLD_BUS.6), SunS_fixture_EGSE_AVR (U1.16)
_SCL: SunS_fixture_EGSE_Connectors (P14.2 PLD_BUS.4), SunS_fixture_EGSE_AVR (R11.2 U1.19)
_SDA: SunS_fixture_EGSE_Connectors (P14.1 PLD_BUS.3), SunS_fixture_EGSE_AVR (R12.2 U1.20)
AVR_RESET: SunS_fixture_EGSE_Connectors (P8.8), SunS_fixture_EGSE_AVR (R9.1)
AVR_TCK: SunS_fixture_EGSE_Connectors (P8.1), SunS_fixture_EGSE_AVR (R24.1)
AVR_TDI: SunS_fixture_EGSE_Connectors (P8.9), SunS_fixture_EGSE_AVR (R30.1)
AVR_TDO: SunS_fixture_EGSE_Connectors (P8.3), SunS_fixture_EGSE_AVR (R28.1)
AVR_TMS: SunS_fixture_EGSE_Connectors (P8.5), SunS_fixture_EGSE_AVR (R26.1)
DTR#0: SunS EGSE Top/SunS_UART (C8_SunS_UART.2), SunS_fixture_EGSE_FTDI (U2.20)
DTR#1: SunS_fixture_EGSE_Connectors (P22.1), SunS_fixture_EGSE_FTDI (U2.36), SunS EGSE Top/AVR_UART (C8_AVR_UART.2)
NetC9_1: SunS_fixture_EGSE_Top (P16.2), SunS_fixture_EGSE_LDO (C9.1 C13.1 U4.1)
NetFB1_2: SunS_fixture_EGSE_Connectors (J1.1), SunS_fixture_EGSE_FTDI (FB1.2)
NetP16_3: SunS_fixture_EGSE_Top (P16.3), SunS_fixture_EGSE_External_Supply (Q1.1 Q1.2 Q1.3 R35.1)
NetP19_1: SunS_fixture_EGSE_Connectors (P19.1), SunS_fixture_EGSE_External_Supply (Q1.5 Q1.6 Q1.7 Q1.8)
NetR23_1: SunS_fixture_EGSE_AVR (R23.1), SunS EGSE Top/AVR_UART (U3_AVR_UART.3)
NetR25_1: SunS_fixture_EGSE_AVR (R25.1), SunS EGSE Top/AVR_UART (U3_AVR_UART.2)
~{RESET}: SunS_fixture_EGSE_AVR (5 pins), SunS EGSE Top/AVR_UART (C8_AVR_UART.1)
RxD0: SunS EGSE Top/SunS_UART (U3_SunS_UART.7), SunS_fixture_EGSE_FTDI (U2.23)
RxD1: SunS_fixture_EGSE_Connectors (P22.2), SunS_fixture_EGSE_FTDI (U2.39), SunS EGSE Top/AVR_UART (U3_AVR_UART.7)
SunS_MCU_RxD: SunS_fixture_EGSE_Connectors (P2.1 R27.1), SunS EGSE Top/SunS_UART (U3_SunS_UART.3)
SunS_MCU_TxD: SunS_fixture_EGSE_Connectors (P2.2 R29.1), SunS EGSE Top/SunS_UART (U3_SunS_UART.2)
SunS_NRST: SunS_fixture_EGSE_Connectors (P2.3 P9.6 R31.1), SunS EGSE Top/SunS_UART (C8_SunS_UART.1)
TxD0: SunS EGSE Top/SunS_UART (U3_SunS_UART.6), SunS_fixture_EGSE_FTDI (U2.24)
TxD1: SunS_fixture_EGSE_Connectors (P22.3), SunS_fixture_EGSE_FTDI (U2.40), SunS EGSE Top/AVR_UART (U3_AVR_UART.6)
USB_N: SunS_fixture_EGSE_Connectors (J1.2), SunS_fixture_EGSE_FTDI (R38.2)
USB_P: SunS_fixture_EGSE_Connectors (J1.3), SunS_fixture_EGSE_FTDI (R39.2)